# EAGLE design mainboard (EAGLE 9.6.2)
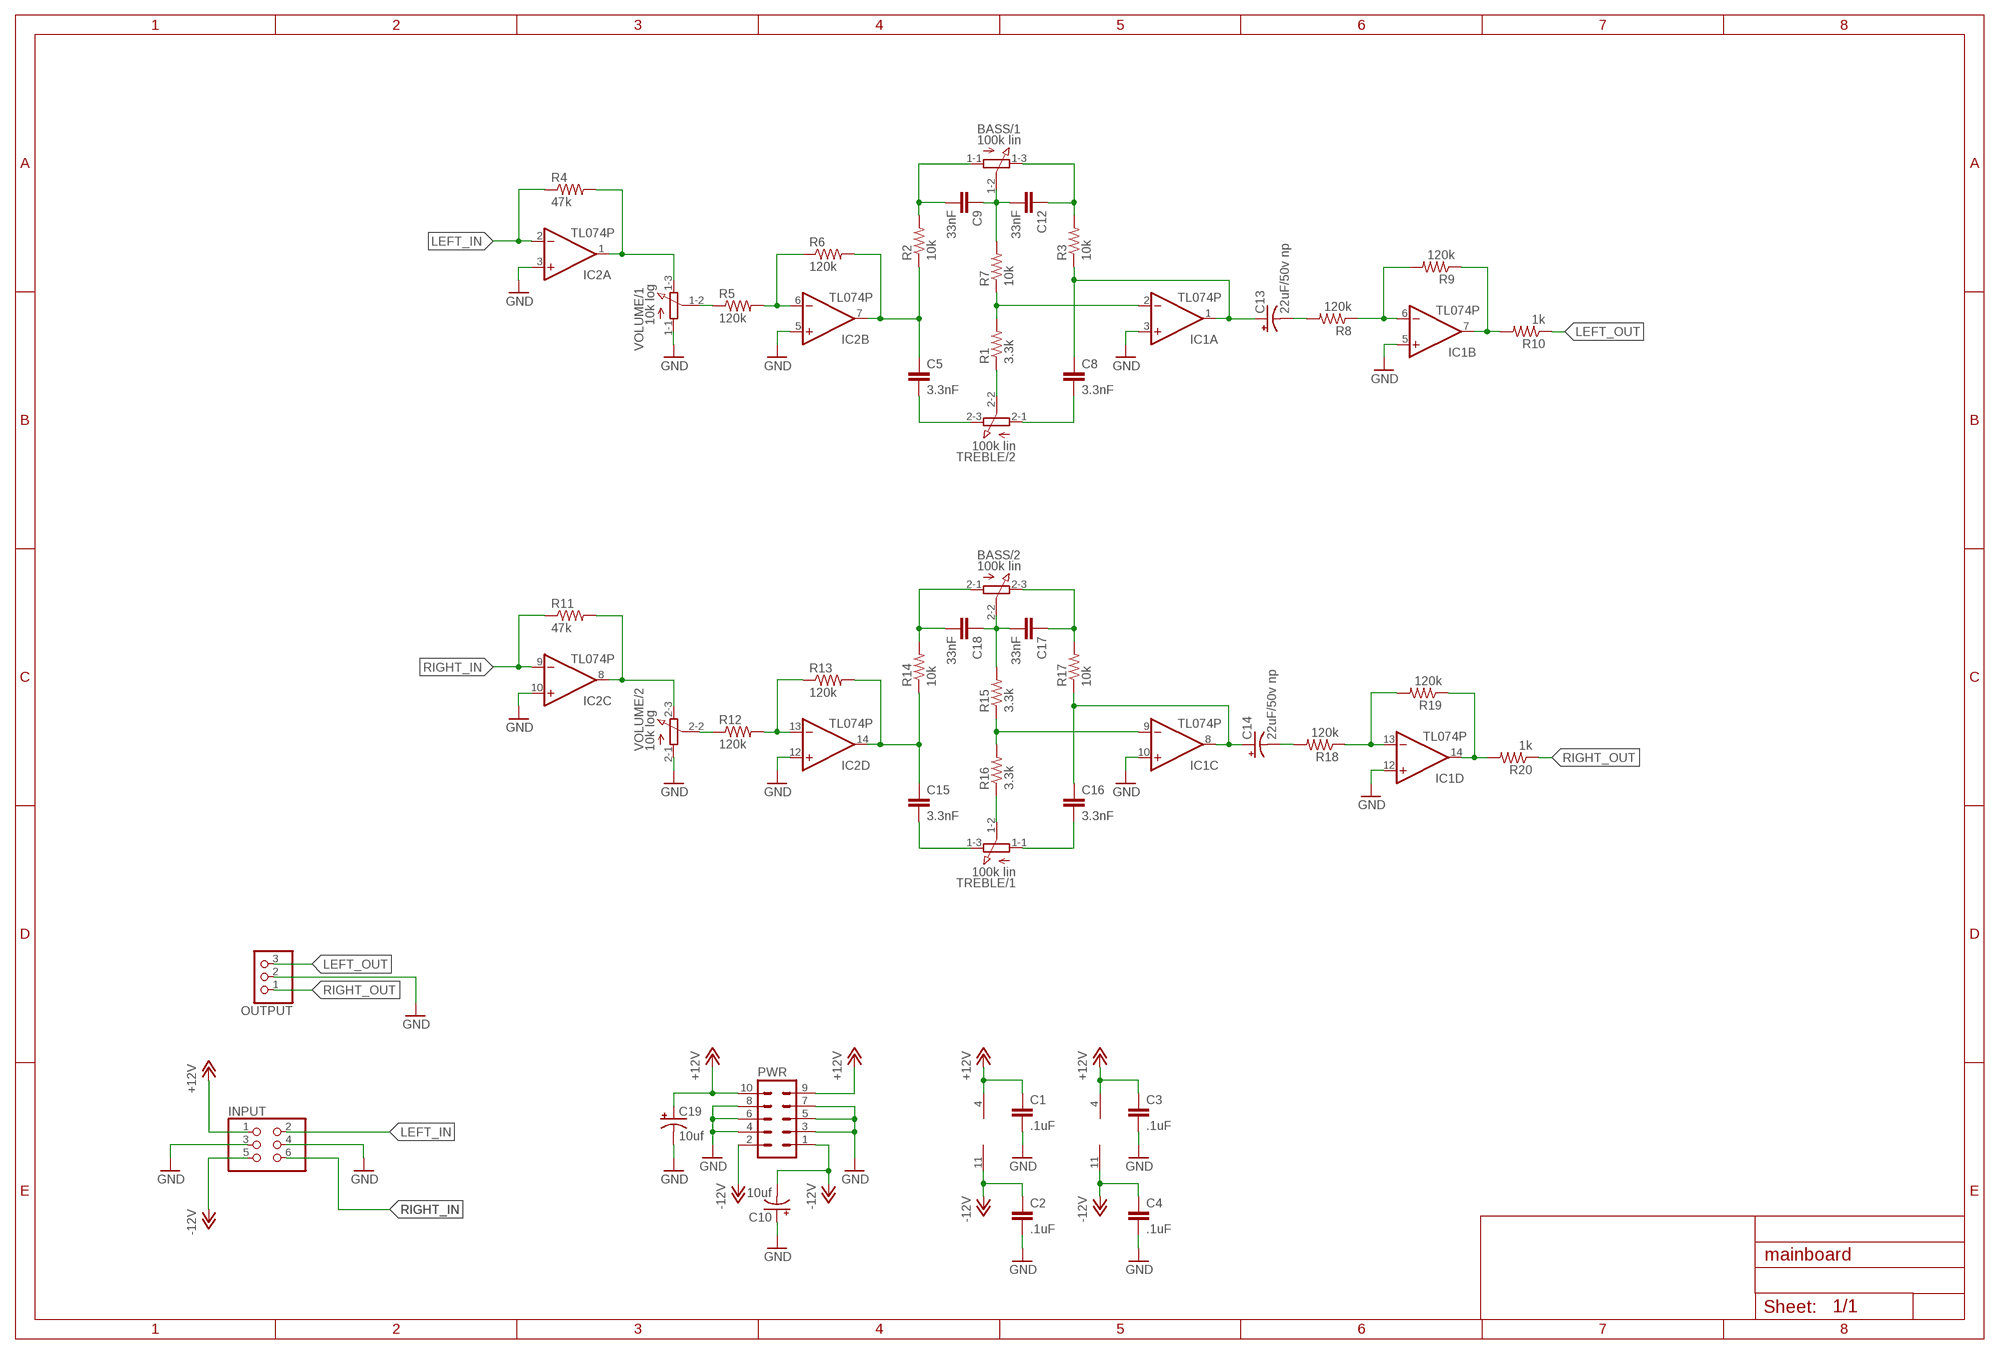
[diagram p0: schematic, sheet 1]

## Parts
BASS  100k lin  3RP/1610G  [3RP/1610G]
C1  .1uF  C-EU050-024X044  [C050-024X044]
C2  .1uF  C-EU050-024X044  [C050-024X044]
C3  .1uF  C-EU050-024X044  [C050-024X044]
C4  .1uF  C-EU050-024X044  [C050-024X044]
C5  3.3nF  C-EU050-025X075  [C050-025X075]
C8  3.3nF  C-EU050-025X075  [C050-025X075]
C9  33nF  C-EU050-025X075  [C050-025X075]
C10  10uf  CPOL-USE2.5-5  [E2,5-5]
C12  33nF  C-EU050-025X075  [C050-025X075]
C13  22uF/50v np  CPOL-USE5-10.5  [E5-10,5]
C14  22uF/50v np  CPOL-USE5-10.5  [E5-10,5]
C15  3.3nF  C-EU050-025X075  [C050-025X075]
C16  3.3nF  C-EU050-025X075  [C050-025X075]
C17  33nF  C-EU050-025X075  [C050-025X075]
C18  33nF  C-EU050-025X075  [C050-025X075]
C19  10uf  CPOL-USE2.5-5  [E2,5-5]
IC1  TL074P  [DIL14]
IC2  TL074P  [DIL14]
INPUT  PINHD-2X3/90  [2X03/90]
OUTPUT  PINHD-1X3  [1X03]
PWR  ML10  [ML10]
R1  3.3k  R-US_0207/7  [0207/7]
R2  10k  R-US_0207/7  [0207/7]
R3  10k  R-US_0207/7  [0207/7]
R4  47k  R-US_0207/7  [0207/7]
R5  120k  R-US_0207/7  [0207/7]
R6  120k  R-US_0207/7  [0207/7]
R7  10k  R-US_0207/7  [0207/7]
R8  120k  R-US_0207/7  [0207/7]
R9  120k  R-US_0207/7  [0207/7]
R10  1k  R-US_0207/7  [0207/7]
R11  47k  R-US_0207/7  [0207/7]
R12  120k  R-US_0207/7  [0207/7]
R13  120k  R-US_0207/7  [0207/7]
R14  10k  R-US_0207/7  [0207/7]
R15  3.3k  R-US_0207/7  [0207/7]
R16  3.3k  R-US_0207/7  [0207/7]
R17  10k  R-US_0207/7  [0207/7]
R18  120k  R-US_0207/7  [0207/7]
R19  120k  R-US_0207/7  [0207/7]
R20  1k  R-US_0207/7  [0207/7]
TREBLE  100k lin  3RP/1610G  [3RP/1610G]
VOLUME  10k log  3RP/1610G  [3RP/1610G]

## Nets
+12V: C1.1 C3.1 C19.+ IC1.4(P:V+) IC2.4(P:V+) INPUT.1 PWR.9 PWR.10
-12V: C2.1 C4.1 C10.- IC1.11(P:V-) IC2.11(P:V-) INPUT.5 PWR.1 PWR.2
GND: C1.2 C2.2 C3.2 C4.2 C10.+ C19.- IC1.3(A:+IN) IC1.5(B:+IN) IC1.10(C:+IN) IC1.12(D:+IN) IC2.3(A:+IN) IC2.5(B:+IN) IC2.10(C:+IN) IC2.12(D:+IN) INPUT.3 INPUT.4 OUTPUT.2 PWR.3 PWR.4 PWR.5 PWR.6 PWR.7 PWR.8 VOLUME.1-1(/1:A) VOLUME.2-1(/2:A)
LEFT_IN: IC2.2(A:-IN) INPUT.2 R4.1
LEFT_OUT: OUTPUT.3 R10.1
N$2: R5.1 VOLUME.1-2(/1:S)
N$3: IC2.1(A:OUT) R4.2 VOLUME.1-3(/1:E)
N$4: IC2.6(B:-IN) R5.2 R6.1
N$5: C5.1 IC2.7(B:OUT) R2.1 R6.2
N$6: R1.1 TREBLE.2-2(/2:S)
N$7: C5.2 TREBLE.2-3(/2:E)
N$8: C8.2 TREBLE.2-1(/2:A)
N$9: BASS.1-1(/1:A) C9.2 R2.2
N$10: BASS.1-3(/1:E) C12.1 R3.2
N$11: BASS.1-2(/1:S) C9.1 C12.2 R7.2
N$12: IC1.2(A:-IN) R1.2 R7.1
N$13: C8.1 C13.+ IC1.1(A:OUT) R3.1
N$14: IC1.6(B:-IN) R8.1 R9.2
N$15: IC1.7(B:OUT) R9.1 R10.2
N$16: C13.- R8.2
N$19: C15.2 TREBLE.1-3(/1:E)
N$20: IC2.8(C:OUT) R11.2 VOLUME.2-3(/2:E)
N$22: R12.1 VOLUME.2-2(/2:S)
N$23: IC2.13(D:-IN) R12.2 R13.1
N$24: C16.2 TREBLE.1-1(/1:A)
N$25: R16.1 TREBLE.1-2(/1:S)
N$26: C15.1 IC2.14(D:OUT) R13.2 R14.1
N$27: IC1.9(C:-IN) R15.1 R16.2
N$28: BASS.2-2(/2:S) C17.2 C18.1 R15.2
N$29: BASS.2-1(/2:A) C18.2 R14.2
N$30: BASS.2-3(/2:E) C17.1 R17.2
N$31: C14.- R18.2
N$32: C14.+ C16.1 IC1.8(C:OUT) R17.1
N$33: IC1.13(D:-IN) R18.1 R19.2
N$36: IC1.14(D:OUT) R19.1 R20.2
RIGHT_IN: IC2.9(C:-IN) INPUT.6 R11.1
RIGHT_OUT: OUTPUT.1 R20.1

## Library data of the parts
BASS TREBLE VOLUME = pot:3RP/1610G: 16mm Potentiometer two level Source: http://www.alphapotentiometers.net/html/16mm_pot_2.html
C1-C5 C8 C9 C12 C15-C18 = rcl:C-EU: CAPACITOR, European symbol; SPICEPREFIX: C
C10 C19 = resistor:CPOL-US: POLARIZED CAPACITOR, American symbol
C13 C14 = rcl:CPOL-US: POLARIZED CAPACITOR, American symbol; SPICEPREFIX: C
IC1 IC2 = linear:TL074: OP AMP
INPUT = pinhead:PINHD-2X3: PIN HEADER
OUTPUT = pinhead:PINHD-1X3: PIN HEADER
PWR = con-ml:ML10: HARTING; OC_FARNELL: unknown; OC_NEWARK: unknown
R1-R20 = rcl:R-US_: RESISTOR, American symbol; SPICEPREFIX: R

## Board
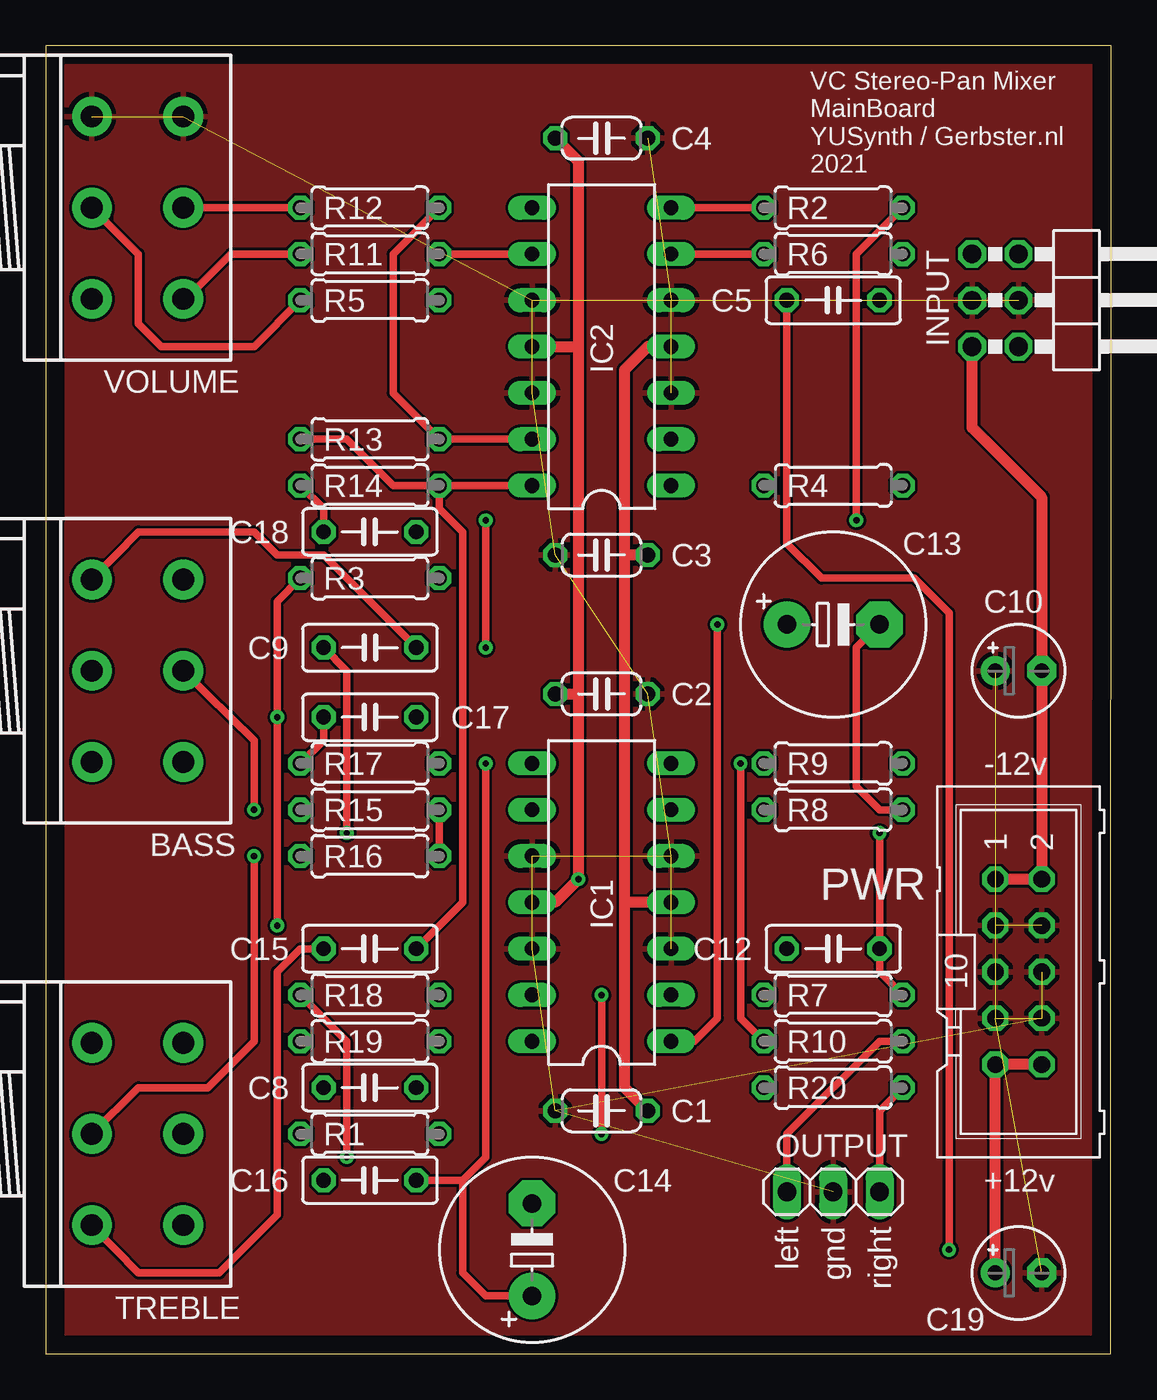
[diagram p1: board, top side]
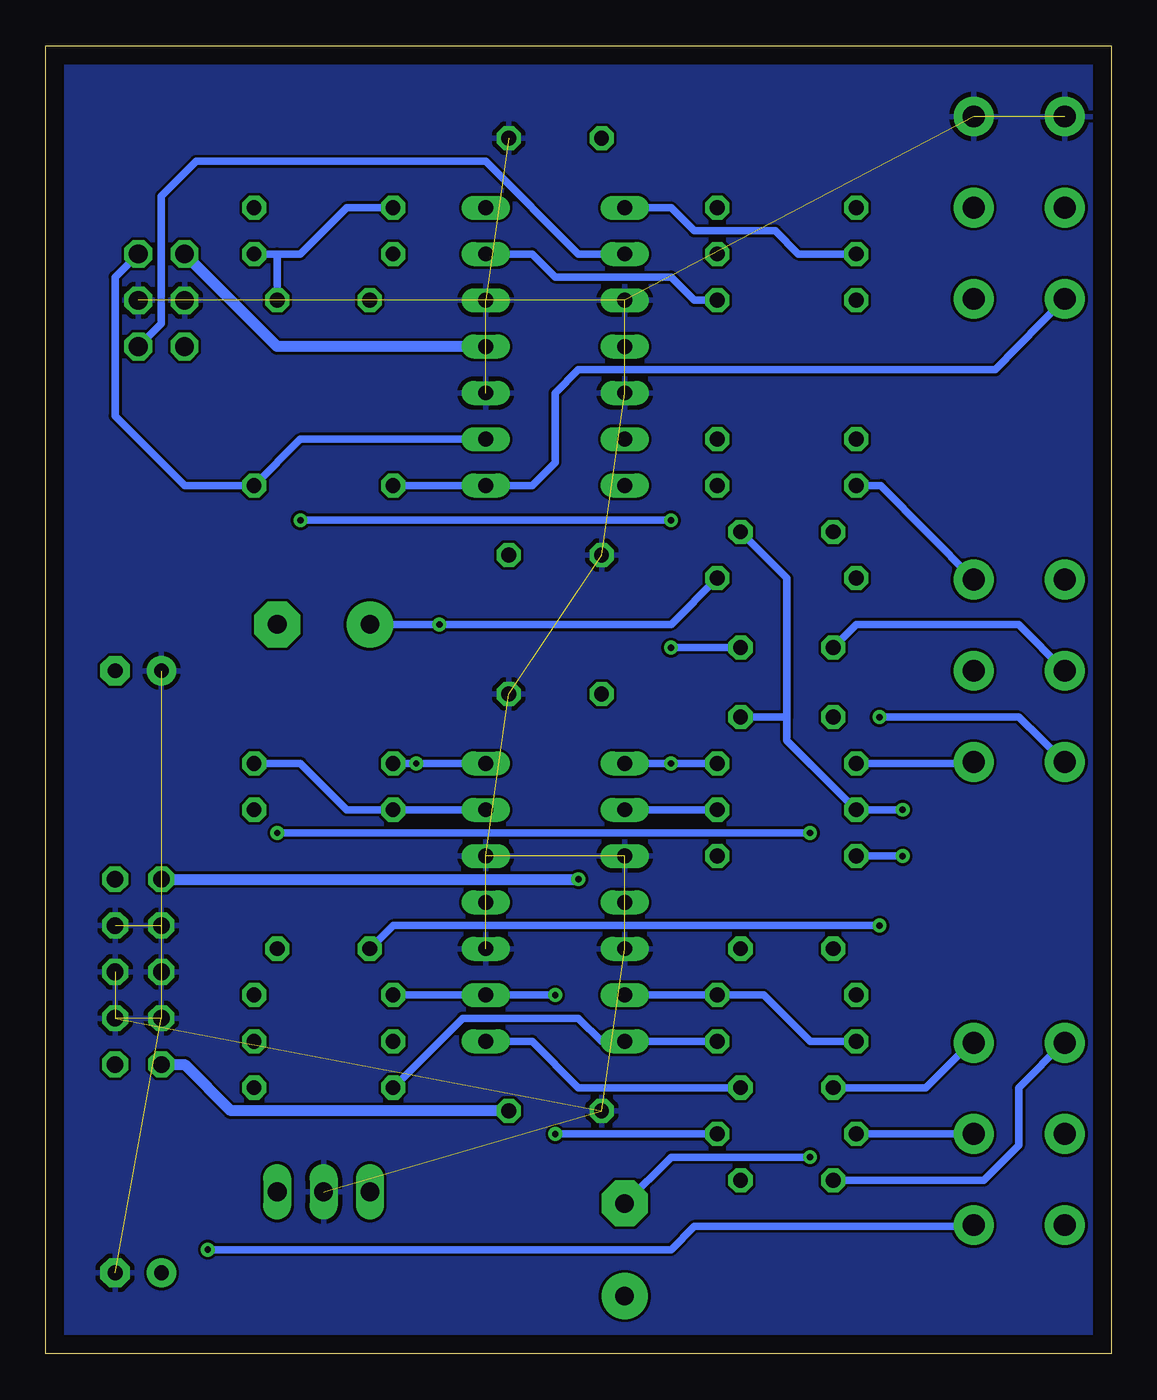
[diagram p2: board, bottom side, seen from below]

Size 58.42 x 71.75 mm. Coordinates in mm from the lower left corner, seen from the top.
Outline: 0,0 58.4,0 58.42,71.75 0,71.75 0,0
Copper layers (1*16): Top 0.035mm / dielectric 1.5mm / Bottom 0.035mm
Design rules "default": minimum track width 6mil, minimum drill 0.35mm, track to track 6mil, track to pad 6mil, pad to pad 6mil, via to via 6mil, smd to smd 6mil, copper to edge 40mil, drill to drill 6mil, minimum pad ring 10mil, minimum via ring 8mil, stop-mask expansion 4mil, vias tented up to drill 0mil, thermal gap 10mil

### Footprints (pad centres in the part's own frame; a part is rotated, then mirrored left to right if it is on the bottom)
3RP/1610G = drill 1.2 pad 2.184: 1-1 -5,0; 1-2 0,0; 1-3 5,0; 2-1 -5,5; 2-2 0,5; 2-3 5,5
C050-024X044 = drill 0.813 octagon: 1 -2.54,0; 2 2.54,0
C050-025X075 = drill 0.813 octagon: 1 -2.54,0; 2 2.54,0
E2,5-5 = drill 0.813 pad 1.6: + -1.27,0 | drill 0.813 pad 1.6 octagon: - 1.27,0
E5-10,5 = drill 1.016 pad 2.54: + -2.54,0 | drill 1.016 pad 2.54 octagon: - 2.54,0
DIL14 = drill 0.813 long: 1 -7.62,-3.81; 2 -5.08,-3.81; 3 -2.54,-3.81; 4 0,-3.81; 5 2.54,-3.81; 6 5.08,-3.81; 7 7.62,-3.81; 8 7.62,3.81; 9 5.08,3.81; 10 2.54,3.81; 11 0,3.81; 12 -2.54,3.81; 13 -5.08,3.81; 14 -7.62,3.81
2X03/90 = drill 1.016 octagon: 1 -2.54,-6.35; 2 -2.54,-3.81; 3 0,-6.35; 4 0,-3.81; 5 2.54,-6.35; 6 2.54,-3.81
1X03 = drill 1.016 long: 1 -2.54,0; 2 0,0; 3 2.54,0
ML10 = drill 0.914 octagon: 1 -5.08,-1.27; 2 -5.08,1.27; 3 -2.54,-1.27; 4 -2.54,1.27; 5 0,-1.27; 6 0,1.27; 7 2.54,-1.27; 8 2.54,1.27; 9 5.08,-1.27; 10 5.08,1.27
0207/7 = drill 0.813 octagon: 1 -3.81,0; 2 3.81,0

### Placement (x,y rotation side)
BASS  2.54,37.47 270 top
C1  30.48,13.34 180 top
C2  30.48,36.2 0 top
C3  30.48,43.81 180 top
C4  30.48,66.67 0 top
C5  43.18,57.78 180 top
C8  17.78,14.61 180 top
C9  17.78,38.73 0 top
C10  53.34,37.47 0 top
C12  43.18,22.23 0 top
C13  43.18,40.01 0 top
C14  26.67,5.71 90 top
C15  17.78,22.23 180 top
C16  17.78,9.53 180 top
C17  17.78,34.92 0 top
C18  17.78,45.09 180 top
C19  53.34,4.45 0 top
IC1  30.48,24.77 90 top
IC2  30.48,55.24 90 top
INPUT  57.15,57.78 270 top
OUTPUT  43.18,8.89 180 top
PWR  53.34,20.95 270 top
R1  17.78,12.06 0 top
R2  43.18,62.87 0 top
R3  17.78,42.55 180 top
R4  43.18,47.62 180 top
R5  17.78,57.78 0 top
R6  43.18,60.33 0 top
R7  43.18,19.68 0 top
R8  43.18,29.84 0 top
R9  43.18,32.38 0 top
R10  43.18,17.14 180 top
R11  17.78,60.33 180 top
R12  17.78,62.87 0 top
R13  17.78,50.16 180 top
R14  17.78,47.62 180 top
R15  17.78,29.84 180 top
R16  17.78,27.3 0 top
R17  17.78,32.38 180 top
R18  17.78,19.68 180 top
R19  17.78,17.14 180 top
R20  43.18,14.61 180 top
TREBLE  2.54,12.06 270 top
VOLUME  2.54,62.87 270 top

### Tracks (layer width: path | path; a pad name or v marks a point on that pad's centre or on a via)
+12V
  Top 0.61: C1.1 31.75,14.61 31.75,24.77 | IC2.4 33.02,55.24 31.75,53.98 31.75,43.81 | 31.75,24.77 31.75,43.81 | IC1.4 31.75,24.77 | C3.1 31.75,43.81 | PWR.10 PWR.9 C19.+
  Bottom 0.61: IC2.4 45.72,55.24 INPUT.1 | C1.1 48.26,13.34 50.8,15.88 PWR.9
-12V  (via drill 0.35)
  Top 0.61: C4.1 29.21,65.41 29.21,55.24 | IC1.11 27.94,24.77 v29.21,26.04 29.21,36.2 | 29.21,55.24 29.21,36.2 | C2.1 29.21,36.2 | IC2.11 29.21,55.24 | INPUT.5 50.8,50.8 54.61,46.99 C10.- PWR.2 PWR.1
  Bottom 0.61: PWR.1 v29.21,26.04
GND  (24 unrouted)
  pour Top: 0,71.75 0,0 58.42,0 58.42,71.75
  pour Bottom: 0,71.75 0,0 58.42,0 58.42,71.75
LEFT_IN
  Bottom 0.406: IC2.2 44.45,50.16 R4.1 50.8,47.62 54.61,51.44 54.61,59.05 INPUT.2
LEFT_OUT
  Top 0.406: R10.1 45.72,17.14 40.64,12.06 OUTPUT.3
N$2
  Top 0.406: VOLUME.1-2 5.08,60.33 5.08,56.52 6.35,55.24 11.43,55.24 R5.1
N$3
  Bottom 0.406: R4.2 IC2.1 31.75,47.62 30.48,48.9 30.48,52.7 29.21,53.98 6.35,53.98 VOLUME.1-3
N$4
  Top 0.406: IC2.6 R6.1
  Bottom 0.406: IC2.6 31.75,60.33 30.48,59.05 24.13,59.05 22.86,57.78 R5.2
N$5
  Top 0.406: R2.1 IC2.7
  Bottom 0.406: R2.1 41.91,62.87 44.45,60.33 45.72,60.33 | R6.2 45.72,60.33 | C5.1 45.72,60.33
N$6
  Bottom 0.406: TREBLE.2-2 R1.1
N$7  (via drill 0.35)
  Top 0.406: C5.2 40.64,44.45 42.55,42.55 47.62,42.55 49.53,40.64 v49.53,5.71
  Bottom 0.406: 7.62,6.99 7.62,6.95 | TREBLE.2-3 7.62,7.07 7.62,6.99 | 7.62,6.99 22.86,6.99 24.13,5.71 v49.53,5.71
N$8
  Bottom 0.406: TREBLE.2-1 7.54,17.14 7.62,17.14 10.16,14.61 C8.2
N$9  (via drill 0.35)
  Top 0.406: BASS.1-1 5.08,45.09 11.43,45.09 12.7,43.81 15.24,43.81 C9.2 | v24.13,38.73 v24.13,45.72 | v44.45,45.72 44.45,60.33 R2.2
  Bottom 0.406: C9.2 v24.13,38.73 | v24.13,45.72 v44.45,45.72
N$10  (via drill 0.35)
  Top 0.406: R3.2 12.7,41.27 v12.7,34.92 v12.7,23.5
  Bottom 0.406: BASS.1-3 5.08,34.92 v12.7,34.92 | v12.7,23.5 39.37,23.5 C12.1
N$11  (via drill 0.35)
  Top 0.406: R7.2 45.72,20.95 C12.2 v45.72,28.57 | C9.1 16.51,37.47 v16.51,28.57
  Bottom 0.406: BASS.1-2 5.08,40.01 13.97,40.01 C9.1 | v16.51,28.57 v45.72,28.57
N$12  (via drill 0.35)
  Top 0.406: v30.48,19.68 v30.48,12.06
  Bottom 0.406: R7.1 IC1.2 v30.48,19.68 | v30.48,12.06 R1.2
N$13  (via drill 0.35)
  Top 0.406: IC1.1 35.56,17.14 36.83,18.41 v36.83,40.01
  Bottom 0.406: C13.+ v36.83,40.01 24.13,40.01 R3.1 | IC1.1 31.75,17.14 29.21,14.61 C8.1
N$14
  Bottom 0.406: IC1.6 R8.1 41.91,29.84 44.45,32.38 R9.2
N$15  (via drill 0.35)
  Top 0.406: R10.2 38.1,18.41 v38.1,32.38
  Bottom 0.406: IC1.7 v38.1,32.38 R9.1
N$16
  Top 0.406: R8.2 45.72,29.84 44.45,31.11 44.45,38.73 C13.-
N$19
  Top 0.406: TREBLE.1-3 5.08,4.45 9.53,4.45 12.7,7.62 12.7,20.95 13.97,22.23 C15.2
N$20
  Top 0.406: R11.2 10.16,60.33 7.62,57.78 7.54,57.78 VOLUME.2-3
  Bottom 0.406: IC2.8 24.13,62.87 22.86,61.59 18.41,61.59 17.14,60.33 R11.2
N$22
  Top 0.406: R12.1 VOLUME.2-2
N$23
  Top 0.406: IC2.13 R13.1 19.05,52.7 19.05,60.33 R12.2
N$24
  Bottom 0.406: TREBLE.1-1 2.54,17.14 5.08,14.61 5.08,11.43 6.99,9.53 C16.2
N$25  (via drill 0.35)
  Top 0.406: TREBLE.1-2 5.08,14.61 8.89,14.61 11.43,17.14 v11.43,27.3
  Bottom 0.406: v11.43,27.3 R16.1
N$26
  Top 0.406: IC2.14 R14.1 | R14.1 19.05,47.62 16.51,50.16 R13.2 | C15.1 22.86,24.77 22.86,45.09 21.59,46.35 R14.1
N$27
  Top 0.406: R15.1 R16.2
  Bottom 0.406: IC1.9 R15.1
N$28  (via drill 0.35)
  Top 0.406: BASS.2-2 11.43,33.66 v11.43,29.84
  Bottom 0.406: v11.43,29.84 R15.2 17.78,33.66 17.78,34.92 | 17.78,34.92 C17.2 | C18.1 17.78,42.55 17.78,34.92
N$29
  Top 0.406: R14.2 15.24,46.35 C18.2
  Bottom 0.406: BASS.2-1 12.62,47.62 R14.2
N$30
  Top 0.406: R17.2 15.24,33.66 C17.1
  Bottom 0.406: BASS.2-3 7.62,32.38 R17.2
N$31  (via drill 0.35)
  Top 0.406: R18.2 16.51,17.14 v16.51,10.79
  Bottom 0.406: v16.51,10.79 24.13,10.79 C14.-
N$32  (via drill 0.35)
  Top 0.406: 22.86,9.53 22.86,4.45 24.13,3.17 C14.+ | C16.1 22.86,9.53 | 22.86,9.53 24.13,10.79 v24.13,32.38
  Bottom 0.406: IC1.8 v24.13,32.38 R17.1
N$33
  Bottom 0.406: IC1.13 R18.1 19.05,19.68 16.51,17.14 R19.2
N$36
  Bottom 0.406: R19.1 IC1.14 27.94,17.14 29.21,18.41 35.56,18.41 R20.2
RIGHT_IN
  Top 0.406: IC2.9 R11.1
  Bottom 0.406: INPUT.6 52.07,56.52 52.07,63.5 50.16,65.41 34.29,65.41 29.21,60.33 IC2.9
RIGHT_OUT
  Top 0.406: R20.1 45.72,13.34 OUTPUT.1

### Text on the board
tNames: VC Stereo-Pan Mixer / MainBoard / YUSynth / Gerbster.nl / 2021 | -12v | +12v | left | gnd | right